# Altium schematic sheet Top.SchDoc: Top
size 296 x 210 mm; Revision: 1.0
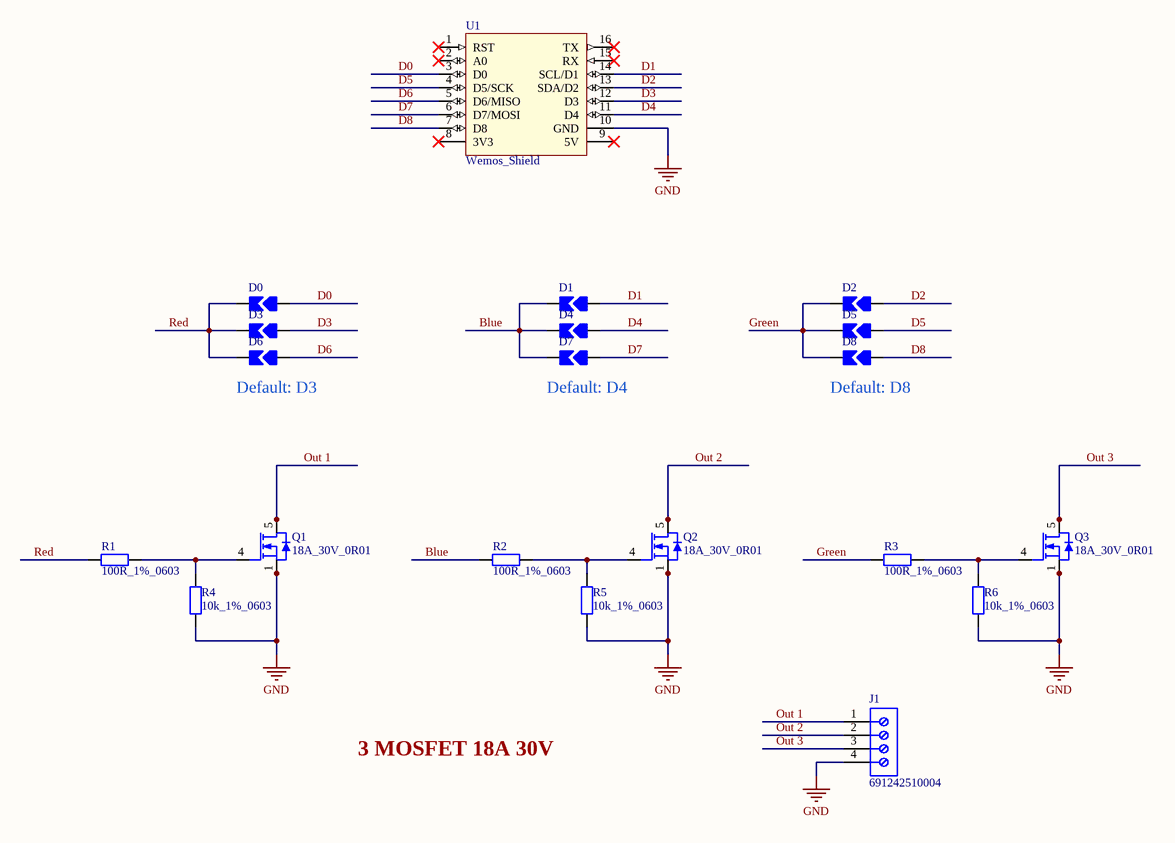
[diagram p0: Top.SchDoc]

## Parts
D0  SWITCH_SOUDABLE  [Switch_Soudable]  (value not drawn)
D1  SWITCH_SOUDABLE  [Switch_Soudable]  (value not drawn)
D2  SWITCH_SOUDABLE  [Switch_Soudable]  (value not drawn)
D3  SWITCH_SOUDABLE  [Switch_Soudable]  (value not drawn)
D4  SWITCH_SOUDABLE  [Switch_Soudable]  (value not drawn)
D5  SWITCH_SOUDABLE  [Switch_Soudable]  (value not drawn)
D6  SWITCH_SOUDABLE  [Switch_Soudable]  (value not drawn)
D7  SWITCH_SOUDABLE  [Switch_Soudable]  (value not drawn)
D8  SWITCH_SOUDABLE  [Switch_Soudable]  (value not drawn)
J1  691242510004  [691242510004]
Q1  18A_30V_0R01  [PQFN8_3.3x3.3]
Q2  18A_30V_0R01  [PQFN8_3.3x3.3]
Q3  18A_30V_0R01  [PQFN8_3.3x3.3]
R1  100R_1%_0603  [R0603]
R2  100R_1%_0603  [R0603]
R3  100R_1%_0603  [R0603]
R4  10k_1%_0603  [R0603]
R5  10k_1%_0603  [R0603]
R6  10k_1%_0603  [R0603]
U1  Wemos_Shield  [WEMOS_D1_MINI]

## Nets
GND: J1.4 Q1.1(S) Q1.2(S) Q1.3(S) Q2.1(S) Q2.2(S) Q2.3(S) Q3.1(S) Q3.2(S) Q3.3(S) R4.1 R5.1 R6.1 U1.10(GND)
Blue: D1.0 D4.0 D7.0 R2.2
D0: D0.1 U1.3(D0)
D1: D1.1 U1.14(SCL/D1)
D2: D2.1 U1.13(SDA/D2)
D3: D3.1 U1.12(D3)
D4: D4.1 U1.11(D4)
D5: D5.1 U1.4(D5/SCK)
D6: D6.1 U1.5(D6/MISO)
D7: D7.1 U1.6(D7/MOSI)
D8: D8.1 U1.7(D8)
Green: D2.0 D5.0 D8.0 R3.2
Out 1: J1.1 Q1.5(D) Q1.6(D) Q1.7(D) Q1.8(D)
Out 2: J1.2 Q2.5(D) Q2.6(D) Q2.7(D) Q2.8(D)
Out 3: J1.3 Q3.5(D) Q3.6(D) Q3.7(D) Q3.8(D)
Red: D0.0 D3.0 D6.0 R1.2
NetQ1_4: Q1.4(G) R1.1 R4.2
NetQ2_4: Q2.4(G) R2.1 R5.2
NetQ3_4: Q3.4(G) R3.1 R6.2

Not connected (* = marked no-connect by the designer): U1 1(RST)* 2(A0)* 8(3V3)* 9(5V)* 15(RX)* 16(TX)*

## Notes on the sheet
- (near D6) Default: D3
- (near D7) Default: D4
- (near D8) Default: D8
- 3 MOSFET 18A 30V
- Verified By :
- Approved By :
- Size:
- Sheet:
- Name:
- A4
- /
- Revision:
- Date:
- Engineer:
- Time:

## Library data of the parts
J1 = 691242510004: WR-TBL Serie 2425 Horizontal Entry Modular, Rising Cage Clamp, pitch 5.08mm, 4p; Compliance: ROHS & Reach; Modularity: No; PCB/Cable/Panel: PCB; Pin Number: 4; Rated Current [UL]: 14A; Working Voltage [UL]: 300VAC; ComponentLink1Description: Manufacturer; ComponentLink1URL: http://www.we-online.de; ComponentLink2URL: https://katalog.we-online.de/em/datasheet/691242510004.pdf; ComponentLink2Description: Datasheet; Mounting Technology: THT; Part Number: 691242510004; Packaging: Box; Operating Temperature: -30 to +120degC; Pitch: 5.08mm; Published Date: October 2019; Type: Horizontal; Publisher: Wurth Elektronik; Application: Rising Cage Clamp
Q1-Q3 = MOSFET-N: N-Channel MOSFET; MPN: IRFHM8337; MF: INFINEON; Supplier Pricing 1: 0.307€; Supplier Part Number 1: 2839488; Supplier 1: Farnell
R1-R3 = RES: Resistor; MPN: MCWR06X1000FTL; MF: MULTICOMP; Supplier Pricing 1: 0.0049 €; Supplier Part Number 1: 2447227; Supplier 1: Farnell
R4-R6 = RES: Resistor; MPN: MCWR06X1002FTL; MF: MULTICOMP; Supplier Pricing 1: 0.0043 €; Supplier Part Number 1: 2447230; Supplier 1: Farnell
U1 = ESP8266: MF: *; MPN: *; Supplier 1: *; Supplier Pricing 1: *; Supplier Part Number 1: *